# Altium schematic sheet XBeeCct.SchDoc
size A
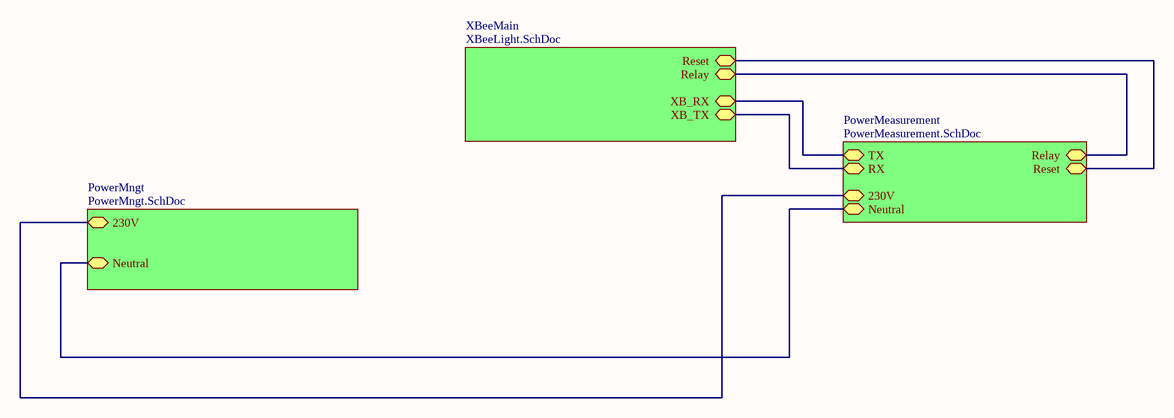
[diagram p0: XBeeCct.SchDoc]

## Sub-sheets
PowerMeasurement = PowerMeasurement.SchDoc: TX, RX, Relay, Reset, 230V, Neutral
PowerMngt = PowerMngt.SchDoc: 230V, Neutral
XBeeMain = XBeeLight.SchDoc: XB_TX, XB_RX, Reset, Relay

## Nets
(unnamed): sheet XBeeMain/XB_TX, sheet PowerMeasurement/RX
(unnamed): sheet XBeeMain/XB_RX, sheet PowerMeasurement/TX
(unnamed): sheet XBeeMain/Reset, sheet PowerMeasurement/Reset
(unnamed): sheet XBeeMain/Relay, sheet PowerMeasurement/Relay
(unnamed): sheet PowerMngt/230V, sheet PowerMeasurement/230V
(unnamed): sheet PowerMngt/Neutral, sheet PowerMeasurement/Neutral